# EasyEDA Pro project ProDocument_Isolated Current Sensor_2024-03-22.epro

# Schematic isolated current sensor
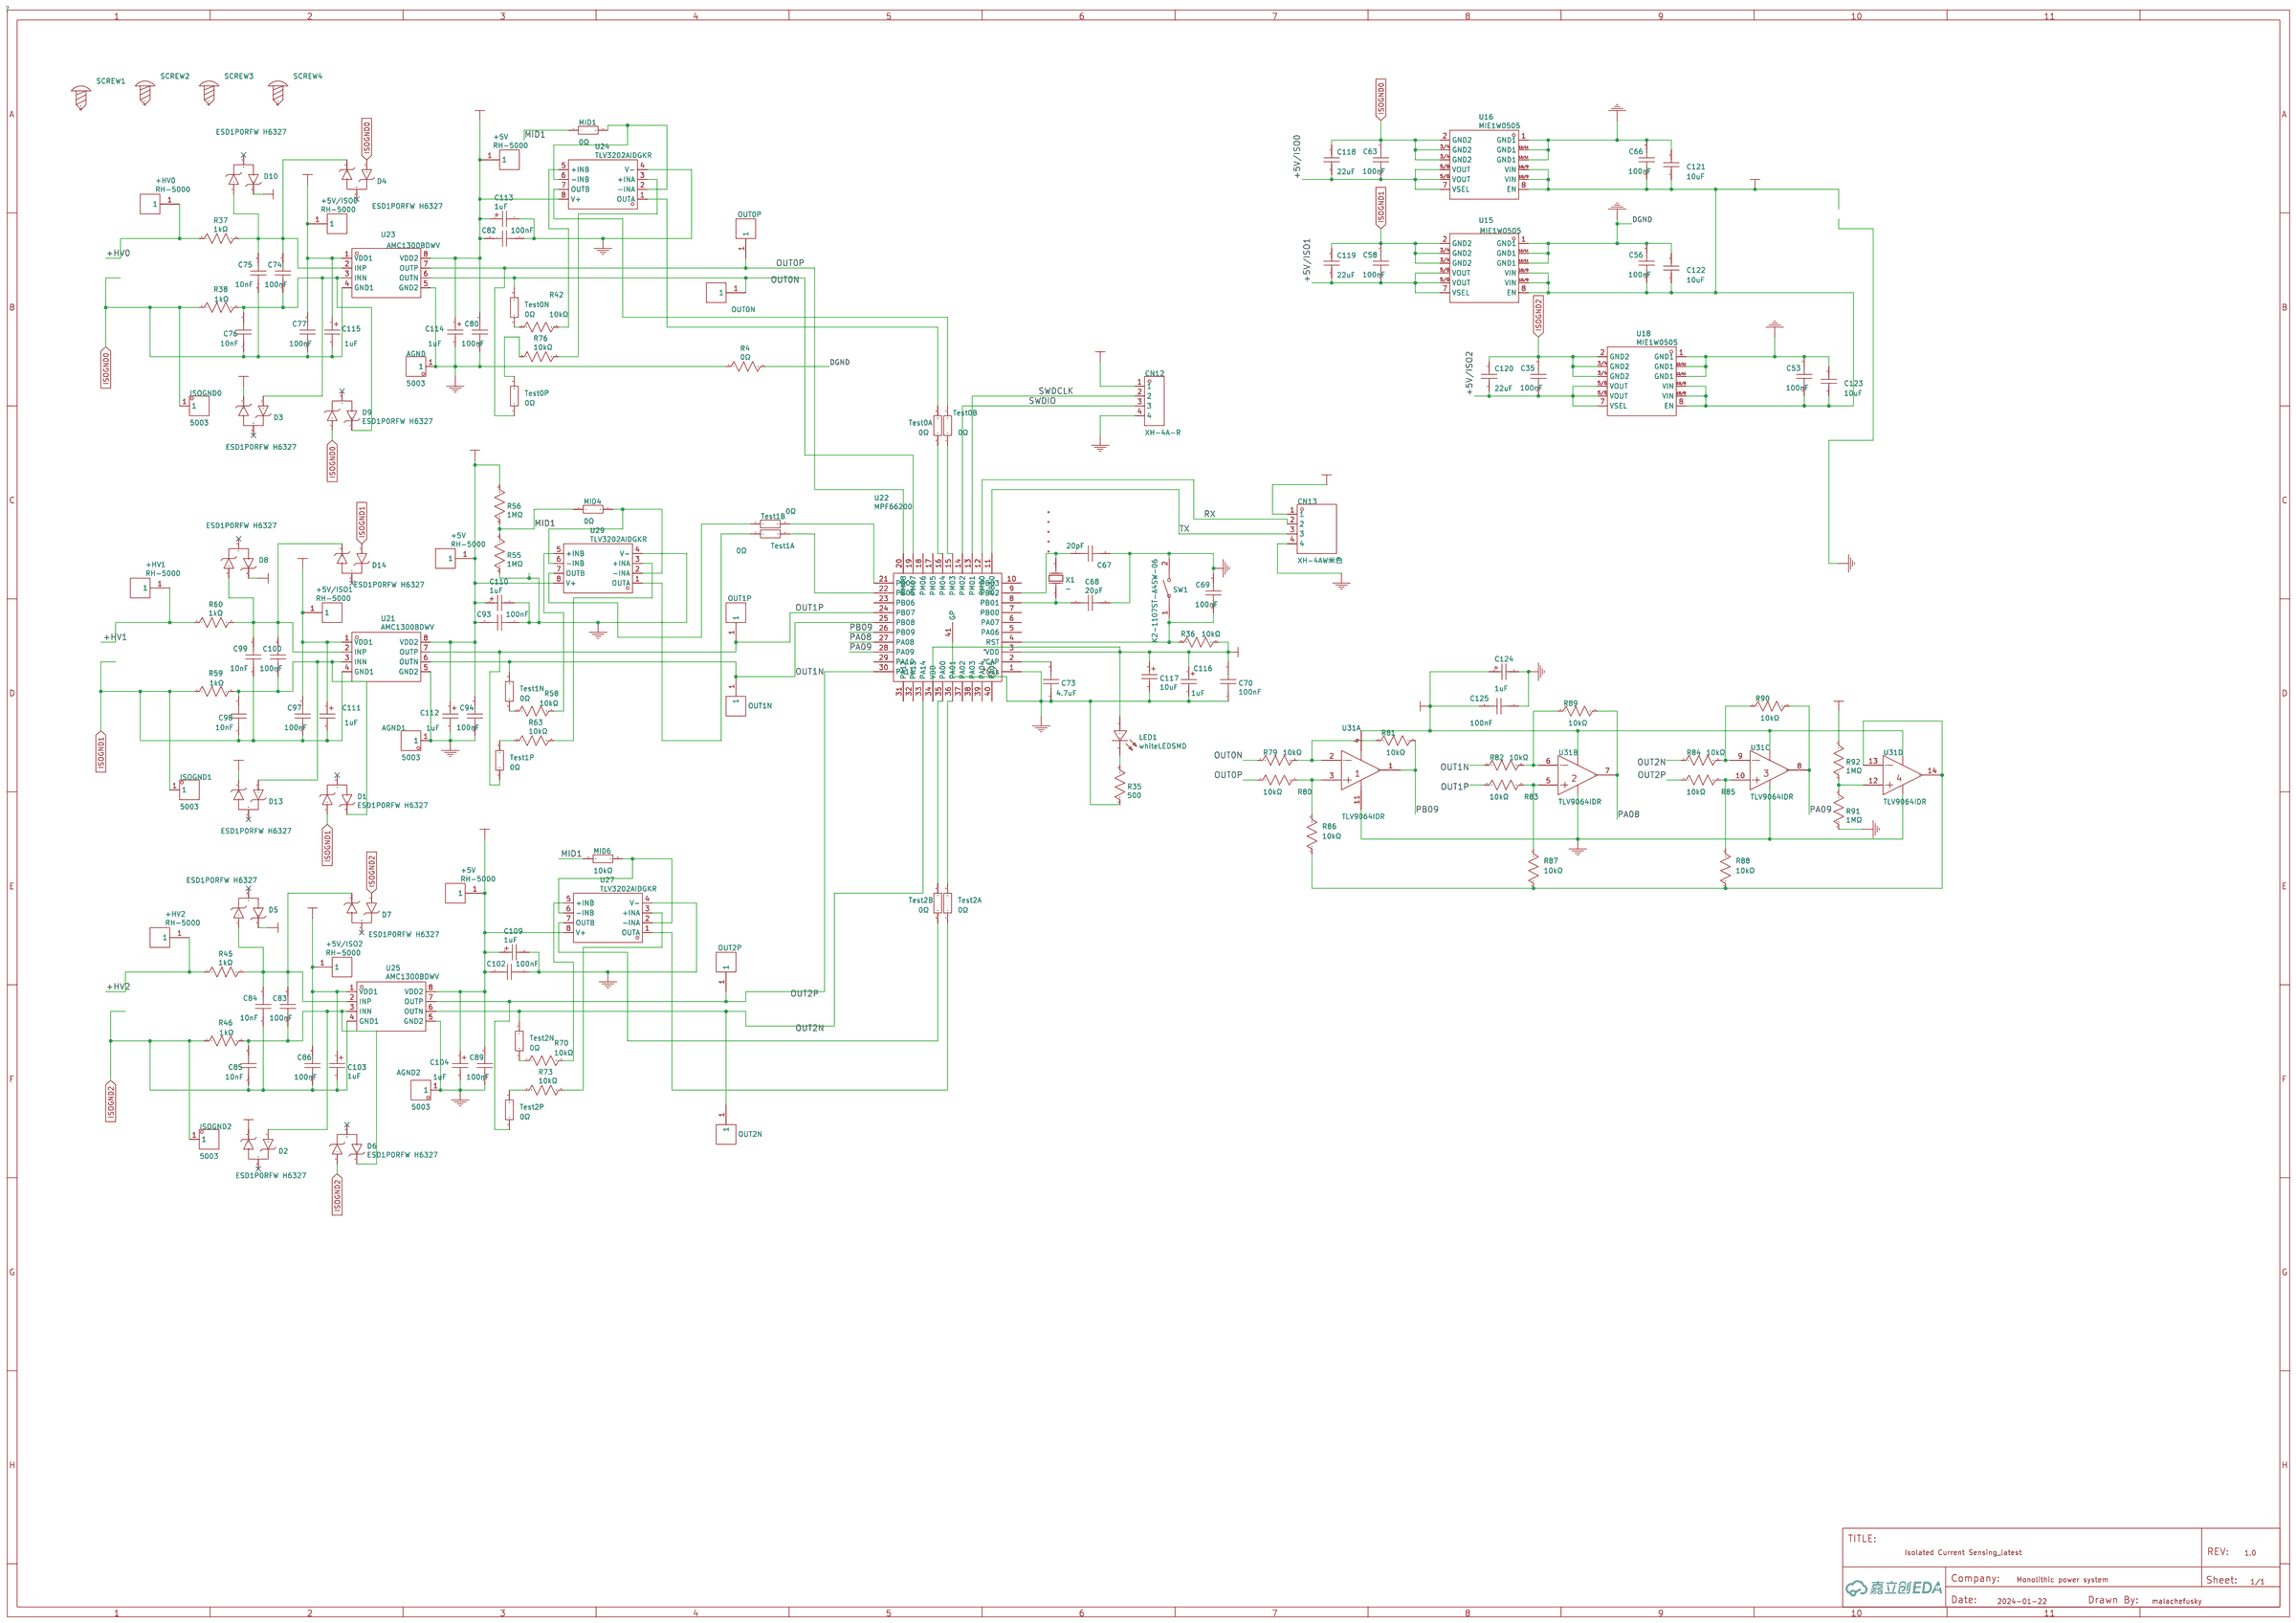
[diagram p0: schematic sheet]

## Parts
+5V  RH-5000  [TEST-TH_BD2.54-P1.4_RED]
+5V#2  RH-5000  [TEST-TH_BD2.54-P1.4_RED]
+5V#3  RH-5000  [TEST-TH_BD2.54-P1.4_RED]
+5V/ISO0  RH-5000  [TEST-TH_BD2.54-P1.4_RED]
+5V/ISO1  RH-5000  [TEST-TH_BD2.54-P1.4_RED]
+5V/ISO2  RH-5000  [TEST-TH_BD2.54-P1.4_RED]
+HV0  RH-5000  [TEST-TH_BD2.54-P1.4_RED]
+HV1  RH-5000  [TEST-TH_BD2.54-P1.4_RED]
+HV2  RH-5000  [TEST-TH_BD2.54-P1.4_RED]
AGND  5003  [TEST-TH_BD2.54-P1.39]
AGND1  5003  [TEST-TH_BD2.54-P1.39]
AGND2  5003  [TEST-TH_BD2.54-P1.39]
C35  100nF  [C0603]
C53  100nF  [C0603]
C56  100nF  [C0603]
C58  100nF  [C0603]
C63  100nF  [C0603]
C66  100nF  [C0603]
C67  20pF  [C0603]
C68  20pF  [C0603]
C69  100nF  [C0603]
C70  100nF  [C0603]
C73  4.7uF  [C0603]
C74  100nF  [C0603]
C75  10nF  [C0603]
C76  10nF  [C0603]
C77  100nF  [C0603]
C80  100nF  [C0603]
C82  100nF  [C0603]
C83  100nF  [C0603]
C84  10nF  [C0603]
C85  10nF  [C0603]
C86  100nF  [C0603]
C89  100nF  [C0603]
C93  100nF  [C0603]
C94  100nF  [C0603]
C97  100nF  [C0603]
C98  10nF  [C0603]
C99  10nF  [C0603]
C100  100nF  [C0603]
C102  100nF  [C0603]
C103  1uF  [CASE-A_3216]
C104  1uF  [CASE-A_3216]
C109  1uF  [CASE-A_3216]
C110  1uF  [CASE-A_3216]
C111  1uF  [CASE-A_3216]
C112  1uF  [CASE-A_3216]
C113  1uF  [CASE-A_3216]
C114  1uF  [CASE-A_3216]
C115  1uF  [CASE-A_3216]
C116  1uF  [CASE-A_3216]
C117  10uF  [CASE-A_3216]
C118  22uF  [C1206]
C119  22uF  [C1206]
C120  22uF  [C1206]
C121  10uF  [C1206]
C122  10uF  [C1206]
C123  10uF  [C1206]
C124  1uF  [CASE-A_3216]
C125  100nF  [C0603]
CN12  XH-4A-R  [CONN-TH_XH-4A-RED]
CN13  XH-4AW米色  [CONN-TH_XH2.54-4AW]
D1  ESD1P0RFW H6327  [SOT-323-3_L2.0-W1.3-P1.30-LS2.1-BL]
D2  ESD1P0RFW H6327  [SOT-323-3_L2.0-W1.3-P1.30-LS2.1-BL]
D3  ESD1P0RFW H6327  [SOT-323-3_L2.0-W1.3-P1.30-LS2.1-BL]
D4  ESD1P0RFW H6327  [SOT-323-3_L2.0-W1.3-P1.30-LS2.1-BL]
D5  ESD1P0RFW H6327  [SOT-323-3_L2.0-W1.3-P1.30-LS2.1-BL]
D6  ESD1P0RFW H6327  [SOT-323-3_L2.0-W1.3-P1.30-LS2.1-BL]
D7  ESD1P0RFW H6327  [SOT-323-3_L2.0-W1.3-P1.30-LS2.1-BL]
D8  ESD1P0RFW H6327  [SOT-323-3_L2.0-W1.3-P1.30-LS2.1-BL]
D9  ESD1P0RFW H6327  [SOT-323-3_L2.0-W1.3-P1.30-LS2.1-BL]
D10  ESD1P0RFW H6327  [SOT-323-3_L2.0-W1.3-P1.30-LS2.1-BL]
D13  ESD1P0RFW H6327  [SOT-323-3_L2.0-W1.3-P1.30-LS2.1-BL]
D14  ESD1P0RFW H6327  [SOT-323-3_L2.0-W1.3-P1.30-LS2.1-BL]
ISOGND0  5003  [TEST-TH_BD2.54-P1.39]
ISOGND1  5003  [TEST-TH_BD2.54-P1.39]
ISOGND2  5003  [TEST-TH_BD2.54-P1.39]
LED1  whiteLEDSMD  [LED0805-R-RD]
MID1  0Ω  [R0402]
MID4  0Ω  [R0402]
MID6  10kΩ  [R0402]
OPAVN1  OUT1N  [TEST-TH_BD2.54-P1.4_RED]
OPAVN2  OUT2N  [TEST-TH_BD2.54-P1.4_RED]
OPAVP0  OUT0P  [TEST-TH_BD2.54-P1.4_RED]
OPAVP1  OUT1P  [TEST-TH_BD2.54-P1.4_RED]
OPAVP2  OUT2P  [TEST-TH_BD2.54-P1.4_RED]
OPAVP3  OUT0N  [TEST-TH_BD2.54-P1.4_RED]
R4  0Ω  [R0603]
R35  500  [R0603]
R36  10kΩ  [R0603]
R37  1kΩ  [R0603]
R38  1kΩ  [R0603]
R42  10kΩ  [R0603]
R45  1kΩ  [R0603]
R46  1kΩ  [R0603]
R55  1MΩ  [R0603]
R56  1MΩ  [R0603]
R58  10kΩ  [R0603]
R59  1kΩ  [R0603]
R60  1kΩ  [R0603]
R63  10kΩ  [R0603]
R70  10kΩ  [R0603]
R73  10kΩ  [R0603]
R76  10kΩ  [R0603]
R79  10kΩ  [R0603]
R80  10kΩ  [R0603]
R81  10kΩ  [R0603]
R82  10kΩ  [R0603]
R83  10kΩ  [R0603]
R84  10kΩ  [R0603]
R85  10kΩ  [R0603]
R86  10kΩ  [R0603]
R87  10kΩ  [R0603]
R88  10kΩ  [R0603]
R89  10kΩ  [R0603]
R90  10kΩ  [R0603]
R91  1MΩ  [R0603]
R92  1MΩ  [R0603]
SCREW1  -  [M2螺丝]
SCREW2  -  [M2螺丝]
SCREW3  -  [M2螺丝]
SCREW4  -  [M2螺丝]
SW1  K2-1107ST-A4SW-06  [KEY-SMD_L6.2-W3.6-LS8.0]
Test0A  0Ω  [R0402]
Test0B  0Ω  [R0402]
Test0N  0Ω  [R0402]
Test0P  0Ω  [R0402]
Test1A  0Ω  [R0402]
Test1B  0Ω  [R0402]
Test1N  0Ω  [R0402]
Test1P  0Ω  [R0402]
Test2A  0Ω  [R0402]
Test2B  0Ω  [R0402]
Test2N  0Ω  [R0402]
Test2P  0Ω  [R0402]
U15  MIE1W0505  [LGA-MPS]
U16  MIE1W0505  [LGA-MPS]
U18  MIE1W0505  [LGA-MPS]
U21  AMC1300BDWV  [SOIC-8_L7.5-W5.9-P1.27-LS11.5-BL-1]
U22  MPF66200  [VQFN-40_L6.0-W6.0-P0.50-TL-EP4.3]
U23  AMC1300BDWV  [SOIC-8_L7.5-W5.9-P1.27-LS11.5-BL-1]
U24  TLV3202AIDGKR  [VSSOP-8_L3.0-W3.0-P0.65-LS5.0-BL]
U25  AMC1300BDWV  [SOIC-8_L7.5-W5.9-P1.27-LS11.5-BL-1]
U27  TLV3202AIDGKR  [VSSOP-8_L3.0-W3.0-P0.65-LS5.0-BL]
U29  TLV3202AIDGKR  [VSSOP-8_L3.0-W3.0-P0.65-LS5.0-BL]
U31  TLV9064IDR  [SOIC-14_L8.7-W3.9-P1.27-LS6.0-BL]  (sections 1,2,3,4)
X1  -  [HC-49US_L11.5-W4.5-P4.88]

## Library data of the parts
+5V +5V#2 +5V#3 +5V/ISO0-+5V/ISO2 +HV0-+HV2 OPAVN1 OPAVN2 OPAVP0-OPAVP3 = RH-5000: Supplier: LCSC; Supplier Part: C5277086; Manufacturer: 荣和; JLCPCB Part Class: Extended Part
AGND AGND1 AGND2 ISOGND0-ISOGND2 = 5003: 类型:测试环;全长/全高:7.62mm;工作高度:-;接触电阻:-;弹性寿命:-;额定电流:-;额定电压:-;触头材质:磷青铜;触头镀层:-;工作温度范围:-;; Supplier Part: C238124; Manufacturer: Keystone; JLCPCB Part Class: 扩展库; Datasheet: https://atta.szlcsc.com/upload/public/pdf/source/20211115/64B944F8418AA2CF0680BB1B201435FB.pdf; Supplier: LCSC; Type: 测试环; Overall Length/Height: 7.62mm; Contact Material: 磷青铜
C35 C53 C56 C58 C63 C66 C69 C70 C74 C77 C80 C82 C83 C86 C89 C93 C94 C97 C100 C102 C125 = CC0603KRX7R9BB104: 容值:100nF;精度:±10%;额定电压:50V;材质(温度系数):X7R;; LCSC Part Name: 100nF ±10% 50V; Supplier Part: C14663; Manufacturer: YAGEO(国巨); Supplier Footprint: 0603; JLCPCB Part Class: Basic Part; Datasheet: https://atta.szlcsc.com/upload/public/pdf/source/20180910/C282072_33301C7F631E79921B82A8DAC6BCC5B3.pdf; Supplier: LCSC; Tolerance: ±10%; Voltage Rated: 50V; Temperature Coefficient: X7R
C67 C68 = 0603CG200J500NT: 容值:20pF;精度:±5%;额定电压:50V;材质(温度系数):C0G;; LCSC Part Name: 20pF ±5% 50V; Supplier Part: C91702; Manufacturer: FH(风华); Supplier Footprint: 0603; JLCPCB Part Class: Extended Part; Datasheet: https://atta.szlcsc.com/upload/public/pdf/source/20200305/C486355_26A10D38EF8C2A5C37091D0039909270.pdf; Supplier: LCSC; Tolerance: ±5%; Voltage Rated: 50V; Temperature Coefficient: C0G
C73 = CL10A475KO8NNNC: 容值:4.7uF;精度:±10%;额定电压:16V;材质(温度系数):X5R;; LCSC Part Name: 4.7uF ±10% 16V; Supplier Part: C19666; Manufacturer: SAMSUNG(三星); Supplier Footprint: 0603; JLCPCB Part Class: Basic Part; Datasheet: https://atta.szlcsc.com/upload/public/pdf/source/20160218/1457707763339.pdf; Supplier: LCSC; Tolerance: ±10%; Voltage Rated: 16V; Temperature Coefficient: X5R
C75 C76 C84 C85 C98 C99 = CT41G-0603-2X1-50V-0.01μF-K(N): 容值:10nF;精度:±10%;额定电压:50V;材质(温度系数):2X1;; LCSC Part Name: 10nF ±10% 50V; Supplier Part: C136131; Manufacturer: TORCH(火炬); Supplier Footprint: 0603; JLCPCB Part Class: Extended Part; Datasheet: https://atta.szlcsc.com/upload/public/pdf/source/20180104/C136131_15150388659201227415.pdf; Supplier: LCSC; Tolerance: ±10%; Voltage Rated: 50V; Temperature Coefficient: 2X1
C103 C104 C109-C116 C124 = 1uF: Supplier: LCSC; Manufacturer: Sunlord(顺络); Manufacturer Part: TC211A105K035Y; Supplier Part: C128315; JLCPCB Part Class: Extended Part
C117 = 10uF: Supplier: LCSC; Manufacturer: Kyocera AVX; Manufacturer Part: TAJA106M016RNJ; Supplier Part: C8015; JLCPCB Part Class: Extended Part
C118-C120 = CL31A226KAHNNNE: 容值:22uF;精度:±10%;额定电压:25V;材质(温度系数):X5R;; LCSC Part Name: 22uF ±10% 25V; Supplier Part: C12891; Manufacturer: SAMSUNG(三星); Supplier Footprint: 1206; JLCPCB Part Class: 基础库; Datasheet: https://atta.szlcsc.com/upload/public/pdf/source/20160218/1457707763339.pdf; Supplier: LCSC; Tolerance: ±10%; Voltage Rated: 25V; Temperature Coefficient: X5R
C121-C123 = CL31A106KBHNNNE: 容值:10uF;精度:±10%;额定电压:50V;材质(温度系数):X5R;; LCSC Part Name: 10uF ±10% 50V; Supplier Part: C13585; Manufacturer: SAMSUNG(三星); Supplier Footprint: 1206; JLCPCB Part Class: 基础库; Datasheet: https://atta.szlcsc.com/upload/public/pdf/source/20160218/1457707763339.pdf; Supplier: LCSC; Tolerance: ±10%; Voltage Rated: 50V; Temperature Coefficient: X5R
CN12 = XH-4A-R: 插针结构:1x4P;间距:2.5mm;安装方式:直插;参考系列:XH;总PIN数:4P;排数:1;每排PIN数:4;行距:-;额定电流:3A;工作温度范围:-25℃~+85℃;; Supplier Part: C2979568; Manufacturer: HCTL(华灿天禄); Supplier Footprint: 插件,P=2.5mm; JLCPCB Part Class: 扩展库; Datasheet: https://atta.szlcsc.com/upload/public/pdf/source/20230711/68D365716984B4AFE576D1D73D61B465.pdf; Supplier: LCSC; Pins Structure: 1x4P; Pitch: 2.5mm; Mounting Style: 直插; Reference Series: XH; Number of Pins: 4P; Number of Rows: 1; Number of PINs Per Row: 4; Current Rating (Max): 3A; Operating Temperature Range: -25℃~+85℃
CN13 = XH-4AW米色: 插针结构:1x4P;间距:2.5mm;安装方式:弯插;参考系列:XH;总PIN数:4P;排数:1;每排PIN数:4;行距:-;触头材质:-;; LCSC Part Name: 系列:XH 间距:2.5mm 1x4P; Supplier Part: C146115; Manufacturer: BOOMELE(博穆精密); Supplier Footprint: 弯插,P=2.5mm; JLCPCB Part Class: 扩展库; Datasheet: https://atta.szlcsc.com/upload/public/pdf/source/20171115/C146119_15107294155991120596.pdf; Supplier: LCSC; Pins Structure: 1x4P; Pitch: 2.5mm; Mounting Style: 弯插; Reference Series: XH; Number of Pins: 4P; Number of Rows: 1; Number of PINs Per Row: 4
D1-D10 D13 D14 = ESD1P0RFW H6327: Supplier: LCSC; Supplier Part: C535169; Manufacturer: Infineon(英飞凌); JLCPCB Part Class: Extended Part
LED1 = whiteLEDSMD: Supplier: LCSC; Manufacturer: KENTO; Manufacturer Part: KT-0805W; Supplier Part: C34499; JLCPCB Part Class: Basic Part
MID1 MID4 MID6 Test0A Test0B Test0N Test0P Test1A Test1B Test1N Test1P Test2A Test2B Test2N Test2P = RC0402FR-0710KL: 电阻类型:厚膜电阻;阻值:10kΩ;精度:±1%;功率:62.5mW;最大工作电压:50V;温度系数:±100ppm/℃;; LCSC Part Name: 厚膜电阻 10kΩ ±1% 62.5mW; Supplier Part: C60490; Manufacturer: YAGEO(国巨); Supplier Footprint: 0402; JLCPCB Part Class: Extended Part; Datasheet: https://atta.szlcsc.com/upload/public/pdf/source/20170925/C131467_1506321478108990263.pdf; Supplier: LCSC; Type: 厚膜电阻; Tolerance: ±1%; Power(Watts): 62.5mW; Overload Voltage (Max): 50V; Temperature Coefficient: ±100ppm/℃; Operating Temperature Range: -55℃~+155℃
R4 = 0603WAF0000T5E: 电阻类型:厚膜电阻;阻值:0Ω;精度:±1%;功率:100mW;最大工作电压:75V;; LCSC Part Name: 0Ω ±1% 100mW 厚膜电阻; Supplier Part: C21189; Manufacturer: UNI-ROYAL(厚声); Supplier Footprint: 0603; JLCPCB Part Class: Basic Part; Datasheet: https://atta.szlcsc.com/upload/public/pdf/source/20200306/C422600_1E6D84923E4A46A82E41ADD87F860B5C.pdf; Supplier: LCSC; Type: 厚膜电阻; Tolerance: ±1%; Power(Watts): 100mW; Overload Voltage (Max): 75V; Operating Temperature Range: -55℃~+155℃
R35 = 500
R36 = 0603WAF1002T5E: 电阻类型:厚膜电阻;阻值:10kΩ;精度:±1%;功率:100mW;最大工作电压:75V;温度系数:±100ppm/℃;; LCSC Part Name: 厚膜电阻 10kΩ ±1% 100mW; Supplier Part: C25804; Manufacturer: UNI-ROYAL(厚声); Supplier Footprint: 0603; JLCPCB Part Class: Basic Part; Datasheet: https://atta.szlcsc.com/upload/public/pdf/source/20200306/C422600_1E6D84923E4A46A82E41ADD87F860B5C.pdf; Supplier: LCSC; Type: 厚膜电阻; Tolerance: ±1%; Power(Watts): 100mW; Overload Voltage (Max): 75V; Temperature Coefficient: ±100ppm/℃; Operating Temperature Range: -55℃~+155℃
R37 R38 R45 R46 R59 R60 = RT0603BRD071KL: 电阻类型:薄膜电阻;阻值:1kΩ;精度:±0.1%;功率:100mW;最大工作电压:75V;温度系数:±25ppm/℃;; LCSC Part Name: 薄膜电阻 1kΩ ±0.1% 100mW; Supplier Part: C110776; Manufacturer: YAGEO(国巨); Supplier Footprint: 0603; JLCPCB Part Class: Extended Part; Datasheet: https://atta.szlcsc.com/upload/public/pdf/source/20170704/1499151282044.pdf; Supplier: LCSC; Type: 薄膜电阻; Tolerance: ±0.1%; Power(Watts): 100mW; Overload Voltage (Max): 75V; Temperature Coefficient: ±25ppm/℃; Operating Temperature Range: -55℃~+155℃
R42 R58 R63 R70 R73 R76 = RC0603FR-07100KL: 电阻类型:厚膜电阻;阻值:100kΩ;精度:±1%;功率:100mW;最大工作电压:75V;温度系数:±100ppm/℃;; LCSC Part Name: 厚膜电阻 100kΩ ±1% 100mW; Supplier Part: C14675; Manufacturer: YAGEO(国巨); Supplier Footprint: 0603; JLCPCB Part Class: Extended Part; Datasheet: https://atta.szlcsc.com/upload/public/pdf/source/20140324/1457707028752.pdf; Supplier: LCSC; Type: 厚膜电阻; Tolerance: ±1%; Power(Watts): 100mW; Overload Voltage (Max): 75V; Temperature Coefficient: ±100ppm/℃; Operating Temperature Range: -55℃~+155℃
R55 R56 R79-R92 = 0603WAF1004T5E: 电阻类型:厚膜电阻;阻值:1MΩ;精度:±1%;功率:100mW;最大工作电压:75V;温度系数:±100ppm/℃;; LCSC Part Name: 1MΩ ±1% 100mW 厚膜电阻; Supplier Part: C22935; Manufacturer: UNI-ROYAL(厚声); Supplier Footprint: 0603; JLCPCB Part Class: Basic Part; Datasheet: https://atta.szlcsc.com/upload/public/pdf/source/20200306/C422600_1E6D84923E4A46A82E41ADD87F860B5C.pdf; Supplier: LCSC; Type: 厚膜电阻; Tolerance: ±1%; Power(Watts): 100mW; Overload Voltage (Max): 75V; Temperature Coefficient: ±100ppm/℃; Operating Temperature Range: -55℃~+155℃
SCREW1-SCREW4 = M2螺丝: Supplier Footprint: 插件
SW1 = K2-1107ST-A4SW-06: Supplier: LCSC; Supplier Part: C118141; Manufacturer: 韩国韩荣; Manufacturer Part: K2-1107ST-A4DW-06; JLCPCB Part Class: Extended Part
U15 U16 U18 = MIE1W0505: Manufacturer: MPS; Manufacturer Part: MIE1W0505BGLVH; Supplier Part: MIE1W0505BGLVH; link: https://www.monolithicpower.cn/cn/products/mie1w0505bglvh.html?_gl=1*yfrszk*_ga*NTg0MzM5NjI4LjE3MDEwNzU3NTU.*_ga_XNRPF6L9DD*MTcwMTA3ODQxMC4yLjEuMTcwMTA3ODY4MS41My4wLjA.&amp;_ga=2.136936372.521942077.1701075755-584339628.1701075755#social-login-popup
U21 U23 U25 = AMC1300BDWV: Supplier: LCSC; Supplier Part: C2653045; Manufacturer: TI(德州仪器); Manufacturer Part: AMC1300DWVR; JLCPCB Part Class: Extended Part
U22 = MPF66200
U24 U27 U29 = TLV3202AIDGKR: 输入失调电压(Vos):5mV;输入偏置电流(Ib):50pA;; Supplier Part: C478075; Manufacturer: TI(德州仪器); Supplier Footprint: VSSOP-8; JLCPCB Part Class: Extended Part; Datasheet: https://www.ti.com/cn/lit/gpn/tlv3202; Supplier: LCSC; Input Offset Voltage (Vos): 5mV; Input Bias Current (Ib): 50pA; Input Hysteresis Voltage (Vhys): 1.2mV; Common Mode Rejection Ratio (CMRR): 70dB; Supply Voltage: 2.7V~5.5V; Output Type: 推挽; Operating Temperature: -40℃~+125℃
U31 = TLV9064IDR: 放大器数:四路;增益带宽积(GBP):10MHz;输入偏置电流(Ib):0.5pA;压摆率(SR):6.5V/us;带宽(-3db):-;轨到轨:-;; Supplier Part: C388176; Manufacturer: TI(德州仪器); Supplier Footprint: SOIC-14; JLCPCB Part Class: 扩展库; Datasheet: https://www.ti.com/cn/lit/gpn/tlv9064; Supplier: LCSC; Number of Circuits: 四路; Gain Bandwidth Product(GBP): 10MHz; Current - Input Bias(Ib): 0.5pA; Slew Rate(SR): 6.5V/us; Output Current: 50mA; Operating Temperature: -40℃~+125℃
X1 = -: Supplier: LCSC; Manufacturer: HOSONIC(鸿星); Manufacturer Part: E49A25E00000XE10C0; Supplier Part: C112385; JLCPCB Part Class: Extended Part

## Nets
AGND: AGND.1 AGND1.1 AGND2.1 C80.1 C89.1 C94.1 C104.2 C112.2 C114.2 C124.2 C125.1 R4.1 R91.2 U21.5(GND2) U23.5(GND2) U25.5(GND2) U31.11(V-)
DGND: C53.2 C56.2 C66.2 C67.2 C68.2 C69.2 C70.1 C73.1 C82.1 C93.1 C102.1 C109.2 C110.2 C113.2 C116.2 C117.2 C121.2 C122.2 C123.2 CN12.4 CN13.4 R4.2 R35.1 R55.2 SW1.2 U15.1(GND1) U15.12/11(GND1) U16.1(GND1) U16.12/11(GND1) U18.1(GND1) U18.12/11(GND1) U22.1(Vss) U22.41(GP) U24.4(V-) U27.4(V-) U29.4(V-)
+5V/ISO0: +5V/ISO0.1 C63.1 C77.2 C115.1 C118.1 D3.2 D10.2 U16.5/6(VOUT) U16.7(VSEL) U23.1(VDD1)
+5V/ISO1: +5V/ISO1.1 C58.1 C97.2 C111.1 C119.1 D8.2 D13.2 U15.5/6(VOUT) U15.7(VSEL) U21.1(VDD1)
+5V/ISO2: +5V/ISO2.1 C35.1 C86.2 C103.1 C120.1 D2.2 D5.2 U18.5/6(VOUT) U18.7(VSEL) U25.1(VDD1)
+5V/LS: +5V.1 +5V#2.1 +5V#3.1 C53.1 C56.1 C66.1 C70.2 C80.2 C82.2 C89.2 C93.2 C94.2 C102.2 C104.1 C109.1 C110.1 C112.1 C113.1 C114.1 C116.1 C117.1 C121.1 C122.1 C123.1 C124.1 C125.2 CN12.1 CN13.1 LED1.1(A) R36.1 R56.1 R92.1 U15.8(EN) U15.10/9(VIN) U16.8(EN) U16.10/9(VIN) U18.8(EN) U18.10/9(VIN) U21.8(VDD2) U22.3(VDD) U22.34(VDD) U23.8(VDD2) U24.8(V+) U25.8(VDD2) U27.8(V+) U29.8(V+) U31.4(V+)
+HV0: +HV0.1 R37.1
+HV1: +HV1.1 R60.1
+HV2: +HV2.1 R45.1
ISOGND0: C63.2 C75.1 C76.1 C77.1 C115.2 C118.2 D4.1 D9.1 ISOGND0.1 R38.1 U16.2(GND2) U16.3/4(GND2) U23.4(GND1)
ISOGND1: C58.2 C97.1 C98.1 C99.1 C111.2 C119.2 D1.1 D14.1 ISOGND1.1 R59.1 U15.2(GND2) U15.3/4(GND2) U21.4(GND1)
ISOGND2: C35.2 C84.1 C85.1 C86.1 C103.2 C120.2 D6.1 D7.1 ISOGND2.1 R46.1 U18.2(GND2) U18.3/4(GND2) U25.4(GND1)
MID1: MID1.1 MID4.1 MID6.1 R55.1 R56.2
OUT0N: OPAVP3.1 R79.1 Test0N.2 U22.19(PM07) U23.6(OUTN)
OUT0P: OPAVP0.1 R80.1 Test0P.1 U22.20(PM08) U23.7(OUTP)
OUT1N: OPAVN1.1 R82.1 Test1N.2 U21.6(OUTN) U22.25(PB08)
OUT1P: OPAVP1.1 R83.1 Test1P.1 U21.7(OUTP) U22.24(PB07)
OUT2N: OPAVN2.1 R84.1 Test2N.2 U22.33(PA14) U25.6(OUTN)
OUT2P: OPAVP2.1 R85.1 Test2P.1 U22.30(PA11) U25.7(OUTP)
PA08: R89.2 U22.27(PA08) U31.7(OUT2)
PA09: R90.2 U22.28(PA09) U31.8(OUT3)
PB09: R81.2 U22.26(PB09) U31.1(OUT1)
RX: CN13.2 U22.12(PM00)
SWDCLK: CN12.2 U22.13(PM01)
SWDIO: CN12.3 U22.14(PM02)
TX: CN13.3 U22.11(PB10)
Net-(C67-1): C67.1 U22.9(PB02) X1.2(OSC2)
Net-(C68-1): C68.1 U22.8(PB01) X1.1(OSC1)
Net-(C69-1): C69.1 R36.2 SW1.1 U22.4(RST)
Net-(C73-2): C73.2 U22.2(CAP)
Net-(C74-1): C74.1 C76.2 D3.1 D9.2 R38.2 U23.3(INN)
Net-(C74-2): C74.2 C75.2 D4.2 D10.1 R37.2 U23.2(INP)
Net-(C83-1): C83.1 C85.2 D2.1 D6.2 R46.2 U25.3(INN)
Net-(C83-2): C83.2 C84.2 D5.1 D7.2 R45.2 U25.2(INP)
Net-(C98-2): C98.2 C100.1 D1.2 D13.1 R59.2 U21.3(INN)
Net-(C99-2): C99.2 C100.2 D8.1 D14.2 R60.2 U21.2(INP)
Net-(LED1-2): LED1.2(K) R35.2
Net-(MID1-2): MID1.2 U24.2(-INA) U24.6(-INB)
Net-(MID4-2): MID4.2 U29.2(-INA) U29.6(-INB)
Net-(MID6-2): MID6.2 U27.2(-INA) U27.6(-INB)
Net-(R42-1): R42.1 Test0N.1
Net-(R42-2): R42.2 U24.5(+INB)
Net-(R58-1): R58.1 Test1N.1
Net-(R58-2): R58.2 U29.5(+INB)
Net-(R63-1): R63.1 Test1P.2
Net-(R63-2): R63.2 U29.3(+INA)
Net-(R70-1): R70.1 Test2N.1
Net-(R70-2): R70.2 U27.5(+INB)
Net-(R73-1): R73.1 Test2P.2
Net-(R73-2): R73.2 U27.3(+INA)
Net-(R76-1): R76.1 Test0P.2
Net-(R76-2): R76.2 U24.3(+INA)
Net-(R79-2): R79.2 R81.1 U31.2(IN1-)
Net-(R80-2): R80.2 R86.2 U31.3(IN1+)
Net-(R82-2): R82.2 R89.1 U31.6(IN2-)
Net-(R83-2): R83.2 R87.2 U31.5(IN2+)
Net-(R84-2): R84.2 R90.1 U31.9(IN3-)
Net-(R85-2): R85.2 R88.2 U31.10(IN3+)
Net-(R86-1): R86.1 R87.1 R88.1 U31.13(IN4-) U31.14(OUT4)
Net-(R91-1): R91.1 R92.2 U31.12(IN4+)
Net-(Test0A-1): Test0A.1 U22.16(PM04)
Net-(Test0A-2): Test0A.2 U24.1(OUTA)
Net-(Test0B-1): Test0B.1 U22.15(PM03)
Net-(Test0B-2): Test0B.2 U24.7(OUTB)
Net-(Test1A-1): Test1A.1 U29.1(OUTA)
Net-(Test1A-2): Test1A.2 U22.22(PB05)
Net-(Test1B-1): Test1B.1 U29.7(OUTB)
Net-(Test1B-2): Test1B.2 U22.21(PB04)
Net-(Test2A-1): Test2A.1 U27.1(OUTA)
Net-(Test2A-2): Test2A.2 U22.36(PA01)
Net-(Test2B-1): Test2B.1 U27.7(OUTB)
Net-(Test2B-2): Test2B.2 U22.35(PA00)

Not connected (* = marked no-connect by the designer): D1 3*; D2 3*; D3 3*; D4 3*; D5 3*; D6 3*; D7 3*; D8 3*; D9 3*; D10 3*; D13 3*; D14 3*; SCREW1 1; SCREW2 1; SCREW3 1; SCREW4 1; U22 5(PA06) 6(PA07) 7(PB00) 10(PB03) 17(PM05) 18(PM06) 23(PB06) 29(PA10) 31(PA12) 32(PA13) 37(PA02) 38(PA03) 39(PA04) 40(PA05)
